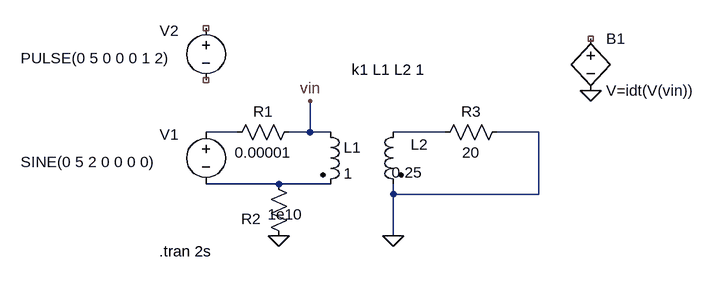
[diagram p0: schematic simulate_transformer.asc]
simulate_transformer.asc, the LTspice schematic file:
Version 4
SHEET 1 880 680
WIRE 32 144 -16 144
WIRE 144 144 144 96
WIRE 144 144 112 144
WIRE 176 144 144 144
WIRE 352 144 272 144
WIRE 496 144 432 144
WIRE 96 224 -16 224
WIRE 176 224 96 224
WIRE 272 240 272 224
WIRE 496 240 496 144
WIRE 496 240 272 240
WIRE 272 304 272 240
FLAG 96 304 0
FLAG 272 304 0
FLAG 576 80 0
FLAG 144 96 vin
SYMBOL voltage -16 128 R0
WINDOW 0 -71 20 Left 2
WINDOW 3 -285 62 Left 2
WINDOW 123 0 0 Left 0
WINDOW 39 0 0 Left 0
SYMATTR InstName V1
SYMATTR Value SINE(0 5 2 0 0 0 0)
SYMBOL ind2 160 128 R0
SYMATTR InstName L1
SYMATTR Value 1
SYMATTR Type ind
SYMBOL ind2 288 128 M0
WINDOW 0 -38 35 Left 2
WINDOW 3 -29 78 Left 2
SYMATTR InstName L2
SYMATTR Value 0.25
SYMATTR Type ind
SYMBOL res 128 128 R90
WINDOW 0 0 56 VBottom 2
WINDOW 3 32 56 VTop 2
SYMATTR InstName R1
SYMATTR Value 0.00001
SYMBOL res 112 320 R180
WINDOW 0 43 42 Left 2
WINDOW 3 -21 49 Left 2
SYMATTR InstName R2
SYMATTR Value 1e10
SYMBOL res 448 128 R90
WINDOW 0 0 56 VBottom 2
WINDOW 3 32 56 VTop 2
SYMATTR InstName R3
SYMATTR Value 20
SYMBOL voltage -16 -32 R0
WINDOW 0 -71 20 Left 2
WINDOW 3 -285 62 Left 2
WINDOW 123 0 0 Left 0
WINDOW 39 0 0 Left 0
SYMATTR InstName V2
SYMATTR Value PULSE(0 5 0 0 0 1 2)
SYMBOL bv 576 -16 R0
SYMATTR InstName B1
SYMATTR Value V=idt(V(vin))
TEXT 208 48 Left 2 !k1 L1 L2 1
TEXT -88 328 Left 2 !.tran 2s

The netlist it stands for:
* simulate_transformer.asc
V1 N001 N003 SINE(0 5 2 0 0 0 0)
L1 vin N003 1
L2 N002 0 0.25
R1 vin N001 0.00001
R2 0 N003 1e10
R3 0 N002 20
V2 NC_01 NC_02 PULSE(0 5 0 0 0 1 2)
B1 NC_03 0 V=idt(V(vin))
k1 L1 L2 1
.tran 2s
.backanno
.end